# Altium schematic sheet SystemStatusBoard.SchDoc
size C
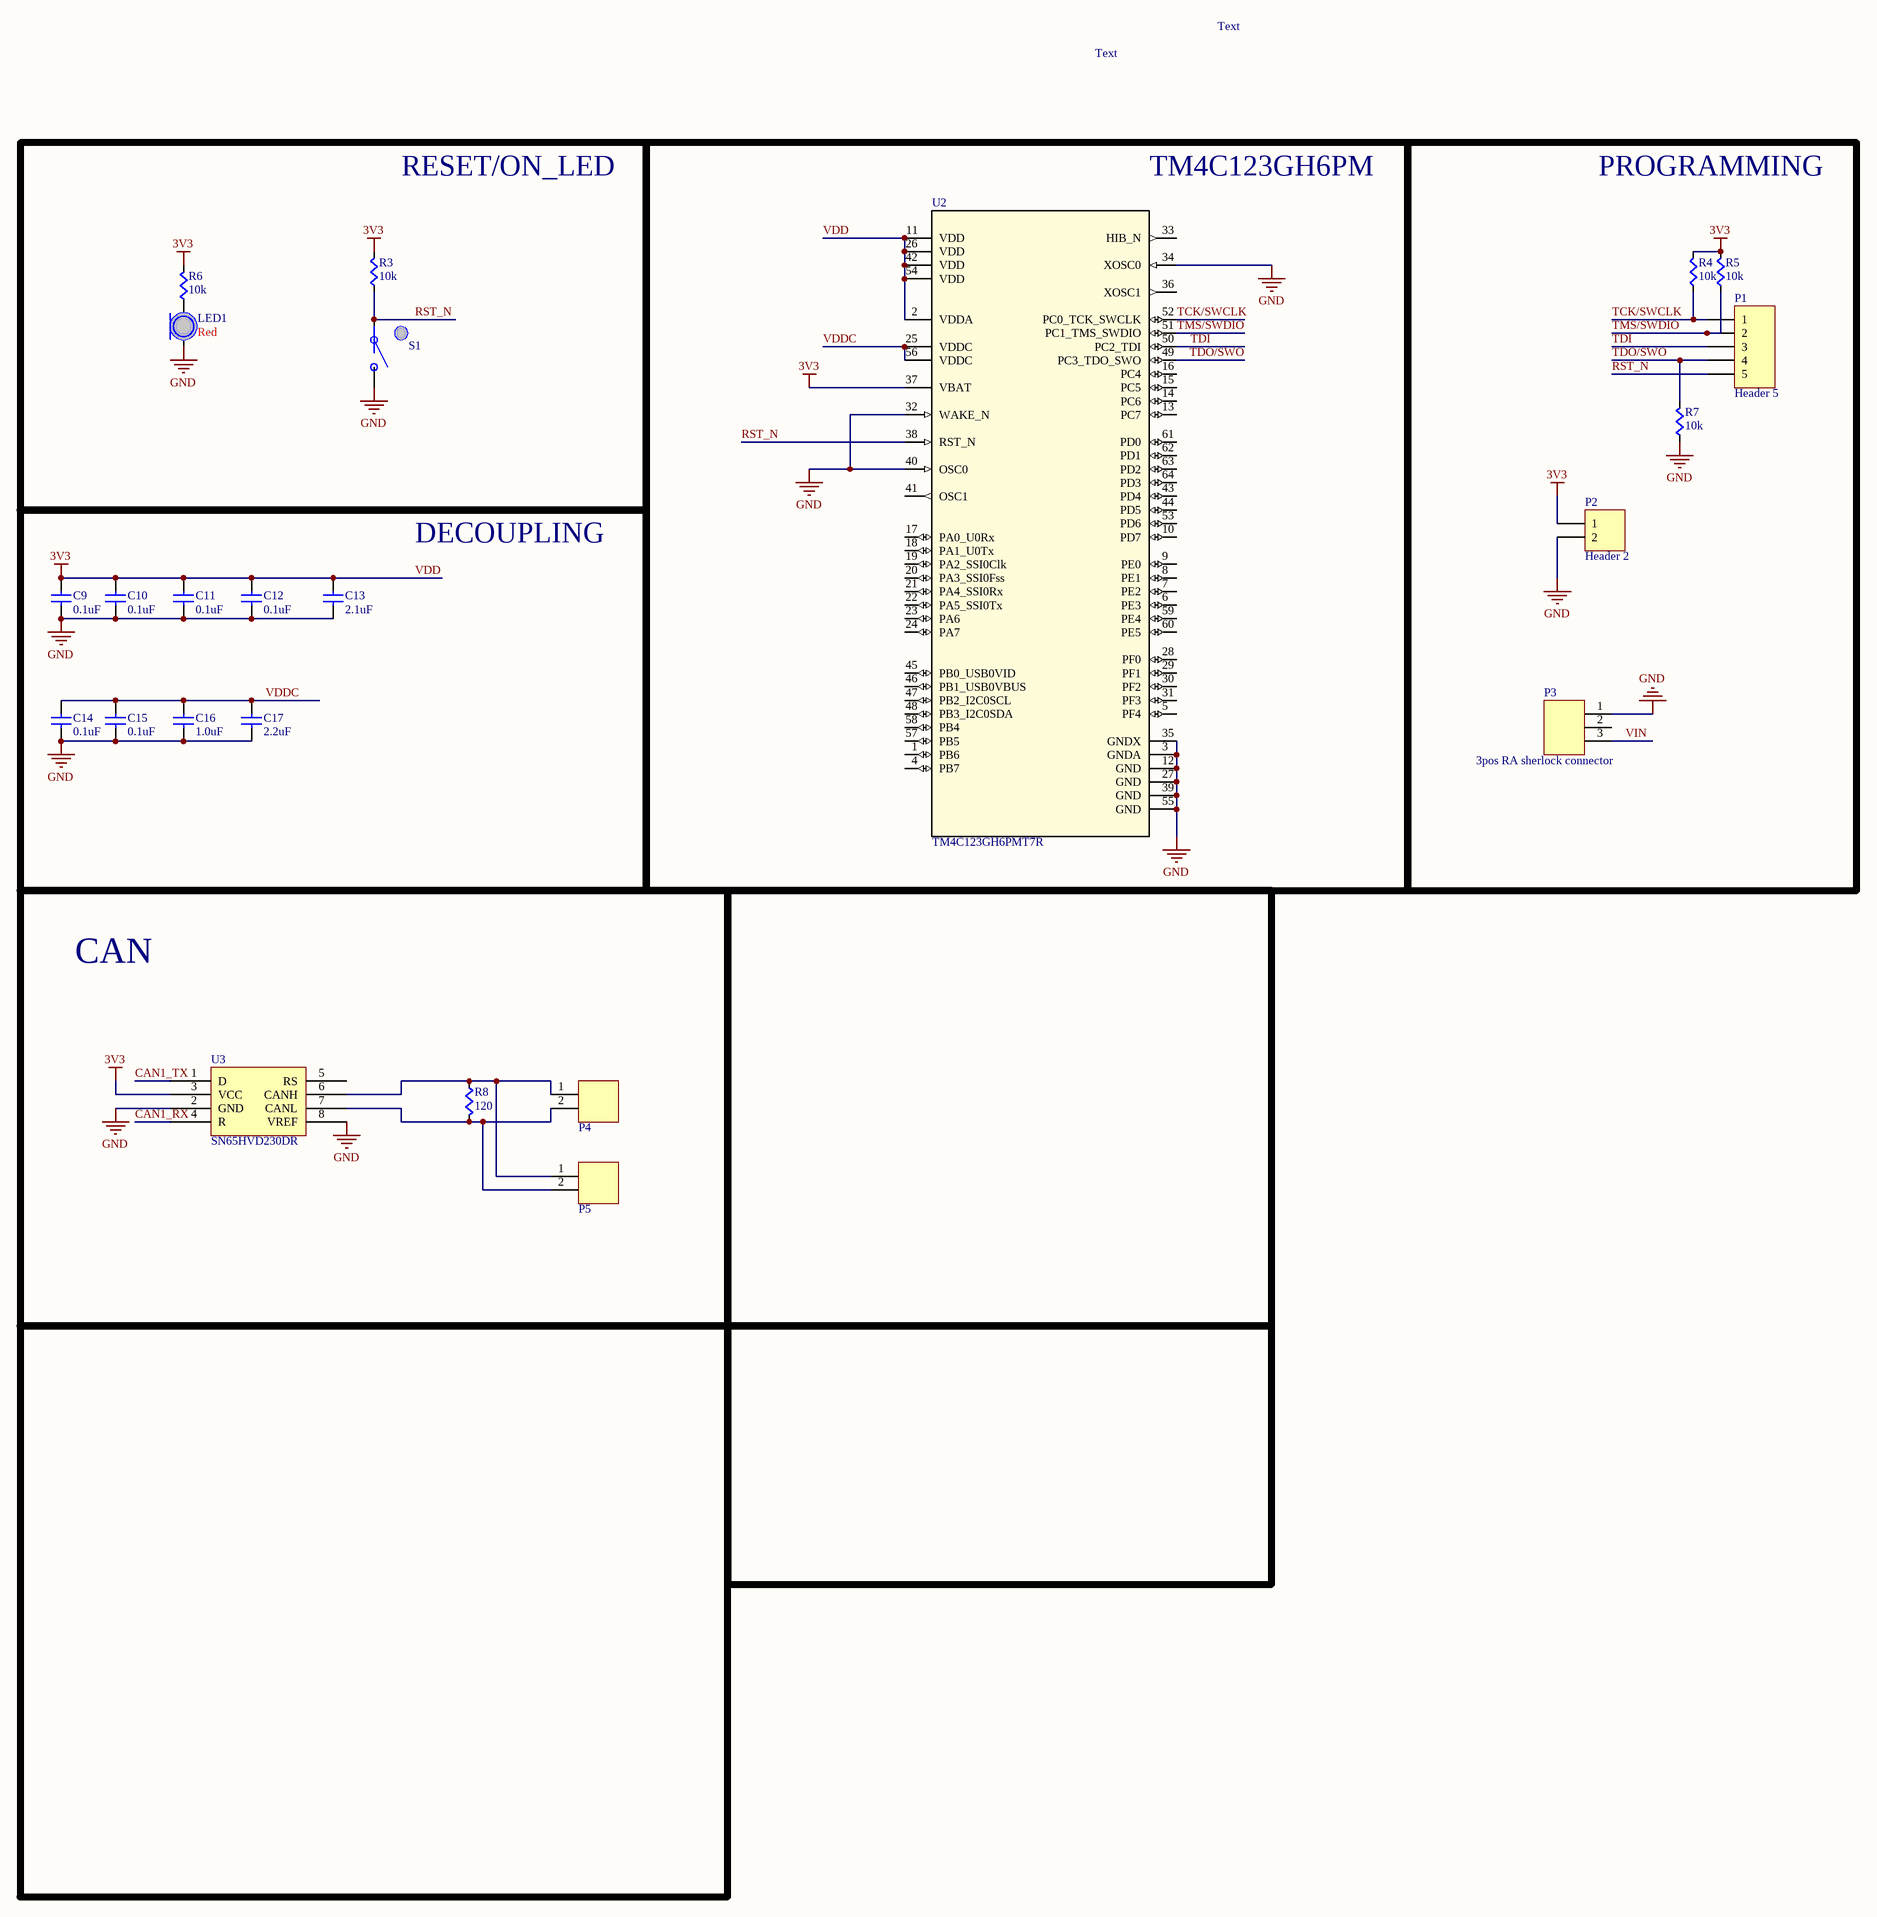
[diagram p0: SystemStatusBoard.SchDoc]

## Parts
C9  value 0.1uF  [CAPC0603]  (hidden comment: Cap)
C10  value 0.1uF  [CAPC0603]  (hidden comment: Cap)
C11  value 0.1uF  [CAPC0603]  (hidden comment: Cap)
C12  value 0.1uF  [CAPC0603]  (hidden comment: Cap)
C13  value 2.1uF  [CAPC0603]  (hidden comment: Cap)
C14  value 0.1uF  [CAPC0603]  (hidden comment: Cap)
C15  value 0.1uF  [CAPC0603]  (hidden comment: Cap)
C16  value 1.0uF  [CAPC0603]  (hidden comment: Cap)
C17  value 2.2uF  [CAPC0603]  (hidden comment: Cap)
LED1  Color: Red  [LED0603]  (hidden comment: LED)
P1  Header 5  [HDR1X5]
P2  Header 2  [HDR1X2]
P3  3pos RA sherlock connector  [MOLEX-HDR-1X3-SHERLOCK-RA]
P4  2-pin Horz Sherlock  [MOLEX-HDR-1X2-SHERLOCK-HORZ]  (value not drawn)
P5  2-pin Horz Sherlock  [MOLEX-HDR-1X2-SHERLOCK-HORZ]  (value not drawn)
R3  value 10k  [RES0603]  (hidden comment: Res)
R4  value 10k  [RES0603]  (hidden comment: Res)
R5  value 10k  [RES0603]  (hidden comment: Res)
R6  value 10k  [RES0603]  (hidden comment: Res)
R7  value 10k  [RES0603]  (hidden comment: Res)
R8  value 120  [RES0603]  (hidden comment: Res)
S1  Button  [PTS645xxxxSMTR92]  (value not drawn)
U2  TM4C123GH6PMT7R  [PM0064A_N]
U3  SN65HVD230DR  [SOIC-8pin]

## Blocks framed on the sheet
RESET/ON_LED: LED1 R3 R6 S1
TM4C123GH6PM: U2
PROGRAMMING: P1-P3 R4 R5 R7
DECOUPLING: C9-C17
CAN: P4 P5 R8 U3

## Nets
GND: C9.2(B) C10.2(B) C11.2(B) C12.2(B) C13.2(B) C14.2(B) C15.2(B) C16.2(B) C17.2(B) LED1.C P2.2 P3.1 R7.2(B) S1.B U2.3(GNDA) U2.12(GND) U2.27(GND) U2.32(WAKE_N) U2.34(XOSC0) U2.35(GNDX) U2.39(GND) U2.40(OSC0) U2.55(GND) U3.2(GND) U3.8(VREF)
VDD: C9.1(A) C10.1(A) C11.1(A) C12.1(A) C13.1(A) P2.1 R3.1(A) R4.1(A) R5.1(A) R6.1(A) U2.2(VDDA) U2.11(VDD) U2.26(VDD) U2.37(VBAT) U2.42(VDD) U2.54(VDD) U3.3(VCC)  [also labelled 3V3]
CAN1_RX: U3.4(R)
CAN1_TX: U3.1(D)
RST_N: P1.5 R3.2(B) S1.A U2.38(RST_N)
TCK/SWCLK: P1.1 R4.2(B) U2.52(PC0_TCK_SWCLK)
TDI: P1.3 U2.50(PC2_TDI)
TDO/SWO: P1.4 R7.1(A) U2.49(PC3_TDO_SWO)
TMS/SWDIO: P1.2 R5.2(B) U2.51(PC1_TMS_SWDIO)
VDDC: C14.1(A) C15.1(A) C16.1(A) C17.1(A) U2.25(VDDC) U2.56(VDDC)
VIN: P3.3
NetLED1_A: LED1.A R6.2(B)
NetP4_1: P4.1 P5.1 R8.2(B) U3.6(CANH)
NetP4_2: P4.2 P5.2 R8.1(A) U3.7(CANL)

Not connected (* = marked no-connect by the designer): P3 2; U2 1(PB6) 4(PB7) 5(PF4) 6(PE3) 7(PE2) 8(PE1) 9(PE0) 10(PD7) 13(PC7) 14(PC6) 15(PC5) 16(PC4) 17(PA0_U0Rx) 18(PA1_U0Tx) 19(PA2_SSI0Clk) 20(PA3_SSI0Fss) 21(PA4_SSI0Rx) 22(PA5_SSI0Tx) 23(PA6) 24(PA7) 28(PF0) 29(PF1) 30(PF2) 31(PF3) 33(HIB_N) 36(XOSC1) 41(OSC1) 43(PD4) 44(PD5) 45(PB0_USB0VID) 46(PB1_USB0VBUS) 47(PB2_I2C0SCL) 48(PB3_I2C0SDA) 53(PD6) 57(PB5) 58(PB4) 59(PE4) 60(PE5) 61(PD0) 62(PD1) 63(PD2) 64(PD3); U3 5(RS)

## Notes on the sheet
- Text

## Library data of the parts
P1 = Header 5: Header, 5-Pin; LatestRevisionDate: 17-Jul-2002; LatestRevisionNote: Re-released for DXP Platform.; Publisher: Altium Limited
P2 = Header 2: Header, 2-Pin; LatestRevisionDate: 17-Jul-2002; LatestRevisionNote: Re-released for DXP Platform.; Publisher: Altium Limited
P3 = MOLEX-HDR-1x3-SHERLOCK_RA: Header, Molex, 2mm Pitch Sherlock Header, Single Row, Right Angle 3 Circuits, Length 3.3mm; Manufacturer Part Number: 35363-0360; Manufacturer: Molex Connector Corporation; Supplier Part Number 1: WM18932-ND; Supplier 1: Digi-Key
P4 P5 = MOLEX-HDR-1x2-SHERLOCK_RA: Header, Molex, 2mm Pitch Sherlock Header, Single Row, Horizontal, 2 Circuits, Length 3.3mm,  0353630260; Manufacturer: Molex Inc; Manufacturer Part Number: 0353630260; Supplier Part Number 1: WM18931-ND; Supplier 1: Digi-Key
S1 = Button: SPST Button; Supplier 1: Digi-Key; Supplier Part Number 1: CKN9087CT-ND
U2 = TM4C123GH6PMT7R: Imported; PartNumber: TM4C123GH6PMTR; Manufacturer: Texas Instruments; CompType: IC; PIN_COUNT: 64; Application_BuildNumber: *; Alternate_PartNumber: TM4C123GH6PMT; PackageReference: PM0064A; MountType: SMT; RoHS: Y; RefDes: RefDes; TYPE: TYPE; Value: Value
U3 = SN65HVD230DR: IC TXRX CAN 1MBPS 3.3V 8SOIC; Supplier 1: Digi-Key; Supplier Part Numbe 1: 296-11654-1-ND
C9-C17 = Cap: Supplier 1: Digi-Key; Supplier Part Number 1: 1276-1000-1-ND
LED1 = LED: Supplier 1: Digi-Key; Supplier Part Number 1: 754-1122-1-ND
R3-R8 = Res: Supplier 1: Digi-Key; Supplier Part Number 1: RMCF0603JT10K0CT-ND